# Altium project KC_BaseBoard4CompareTest_V0.2.PrjPcb
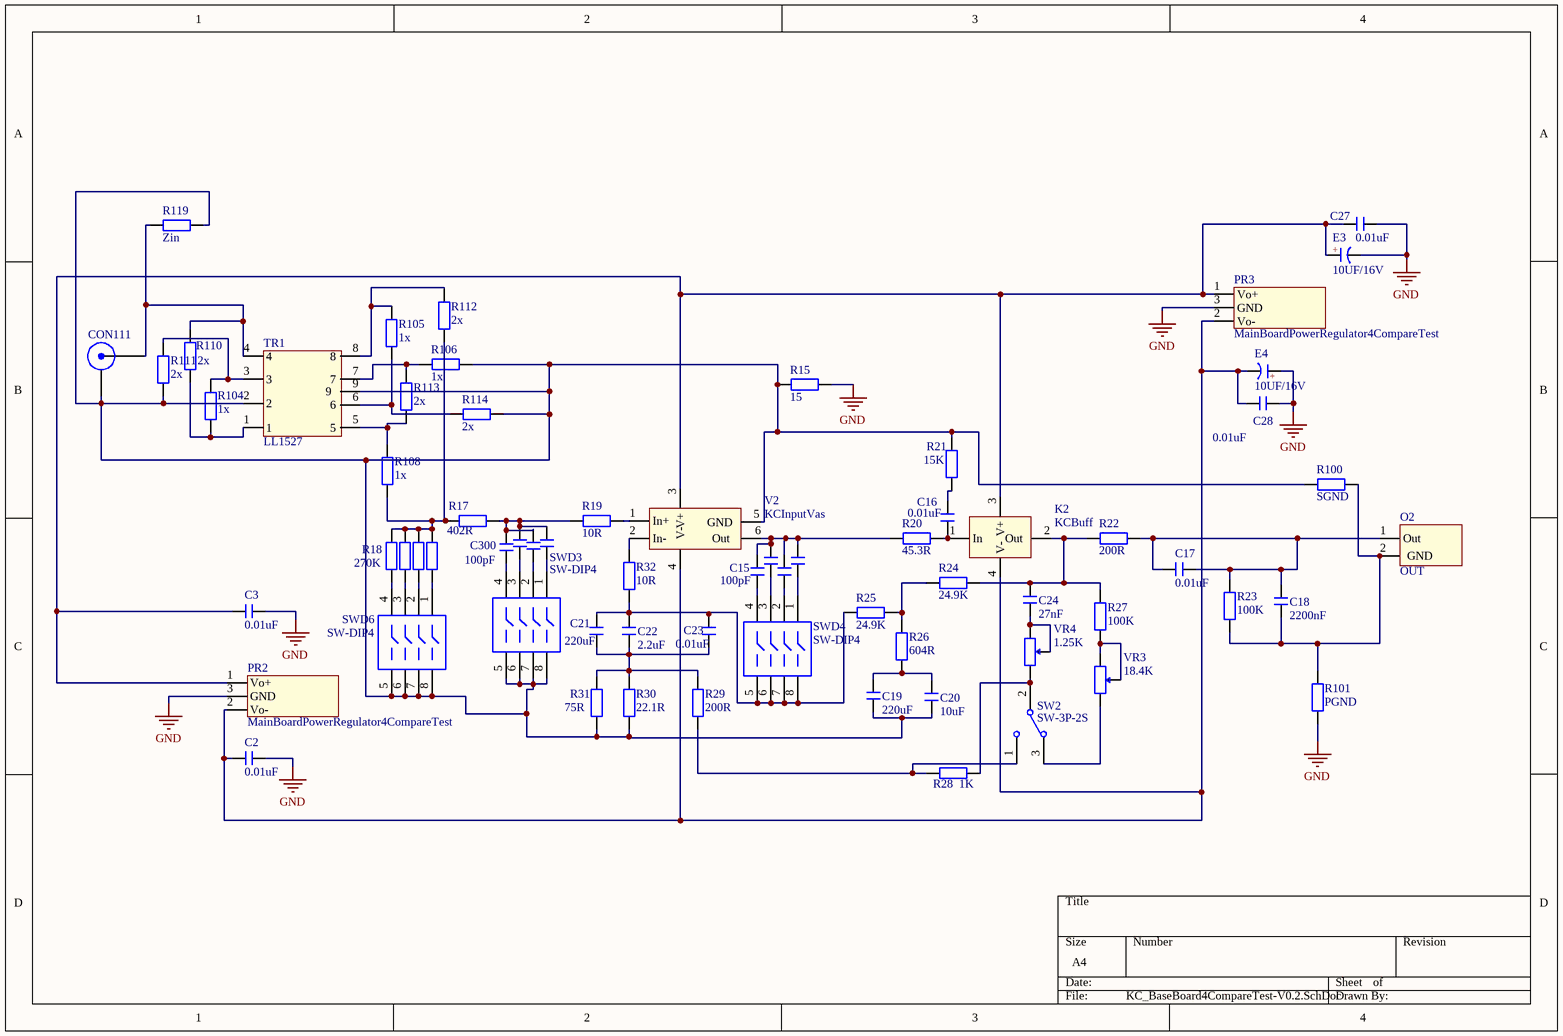
[diagram p0: KC_BaseBoard4CompareTest-V0.2.SchDoc]
1 sheet, 68 parts. Net scope: global (net labels, ports and power ports of the same name join across sheets).
Board file: KC_BaseBoard4CompareTest-V0.2.PcbDoc

## Sheet KC_BaseBoard4CompareTest-V0.2.SchDoc
size A4

### Parts
C2  0.01uF  [CBB 6.3*6.3*5]
C3  0.01uF  [CBB 6.3*6.3*5]
C15  100pF  [CBB 6.3*6.3*5]
C16  0.01uF  [CBB 6.3*6.3*5]
C17  0.01uF  [CBB 6.3*6.3*5]
C18  2200nF  [CBB 6.3*6.3*5]
C19  220uF  [CBB 6.3*6.3*5]
C20  10uF  [CBB 6.3*6.3*5]
C21  220uF  [CBB 6.3*6.3*5]
C22  2.2uF  [CBB 6.3*6.3*5]
C23  0.01uF  [CBB 6.3*6.3*5]
C24  27nF  [CBB 6.3*6.3*5]
C27  0.01uF  [CBB 6.3*6.3*5]
C28  0.01uF  [CBB 6.3*6.3*5]
C300  100pF  [CBB 6.3*6.3*5]
C301  100pF  [CBB 6.3*6.3*5]  (value not drawn)
C302  100pF  [CBB 6.3*6.3*5]  (value not drawn)
C303  20pF  [CBB 6.3*6.3*5]  (value not drawn)
C401  100pF  [CBB 6.3*6.3*5]  (value not drawn)
C402  100pF  [CBB 6.3*6.3*5]  (value not drawn)
C403  20pF  [CBB 6.3*6.3*5]  (value not drawn)
CON111  RCA  [SMB_V-RJ45]  (value not drawn)
E3  10UF/16V  [CAP 1.5*4*8]
E4  10UF/16V  [CAP 1.5*4*8]
K2  KCBuff  [KCBuff_M4]
O2  OUT  [Signal_Terminal]
PR2  MainBoardPowerRegulator4CompareTest  [KC_MBPowerReg4Compare-1.5mm]
PR3  MainBoardPowerRegulator4CompareTest  [KC_MBPowerReg4Compare-1.5mm]
R15  15  [RS 1/4W]
R17  402R  [RS 1/4W]
R18  270K  [RS 1/4W]
R19  10R  [RS 1/4W]
R20  45.3R  [RS 1/4W]
R21  15K  [RS 1/4W]
R22  200R  [RS 1/4W]
R23  100K  [RS 1/4W]
R24  24.9K  [RS 1/4W]
R25  24.9K  [RS 1/4W]
R26  604R  [RS 1/4W]
R27  100K  [RS 1/4W]
R28  1K  [RS 1/4W]
R29  200R  [RS 1/4W]
R30  22.1R  [RS 1/4W]
R31  75R  [RS 1/4W]
R32  10R  [RS 1/4W]
R100  SGND  [RS 1/4W]
R101  PGND  [RS 1/4W]
R104  1x  [RS 1/4W]
R105  1x  [RS 1/4W]
R106  1x  [RS 1/4W]
R108  1x  [RS 1/4W]
R110  2x  [RS 1/4W]
R111  2x  [RS 1/4W]
R112  2x  [RS 1/4W]
R113  2x  [RS 1/4W]
R114  2x  [RS 1/4W]
R119  Zin  [RS 1/4W]
R181  182K  [RS 1/4W]  (value not drawn)
R182  100K  [RS 1/4W]  (value not drawn)
R183  47K  [RS 1/4W]  (value not drawn)
SW2  SW-3P-2S  [SS-12D06]
SWD3  SW-DIP4  [DIP-8]
SWD4  SW-DIP4  [DIP-8]
SWD6  SW-DIP4  [DIP-8]
TR1  LL1527  [LL1527]
V2  KCInputVas  [KCIn_VAS_M4]
VR3  18.4K  [RS 1/2W-VR]
VR4  1.25K  [RS 1/2W-VR]

### Nets
GND: C2.2 C3.2 C27.2 C28.2 E3.2(K) E4.1(A) PR2.3(GND) PR3.3(GND) R15.2 R101.1
NetC2_1: C2.1 C28.1 E4.2(K) K2.4(V-) PR2.2(Vo-) PR3.2(Vo-) V2.4(V-)
NetC3_1: C3.1 C27.1 E3.1(A) K2.3(V+) PR2.1(Vo+) PR3.1(Vo+) V2.3(V+)
NetC15_1: C15.1 SWD4.4
NetC15_2: C15.2 C401.2 C402.2 C403.2 R20.1 V2.6(Out)
NetC16_1: C16.1 K2.1(In) R20.2
NetC16_2: C16.2 R21.1
NetC17_1: C17.1 C17.2 C18.1 O2.1(Out) R22.1 R23.1
NetC18_2: C18.2 O2.2(GND) R23.2 R100.2 R101.2
NetC19_1: C19.1 C20.1 R26.1
NetC19_2: C19.2 C20.2 CON111.2(Y) R15.1 R21.2 R30.1 R31.1 R100.1 R106.2 R111.1 R114.2 R119.2 SWD3.5 SWD3.6 SWD3.7 SWD3.8 SWD6.5 SWD6.6 SWD6.7 SWD6.8 TR1.2 TR1.9 V2.5(GND)
NetC21_1: C21.1 C22.1 C23.1 R25.1 R32.1 SWD4.5 SWD4.6 SWD4.7 SWD4.8
NetC21_2: C21.2 C22.2 C23.2 R29.2 R30.2 R31.2
NetC24_1: C24.1 K2.2(Out) R22.2 R24.2 R27.1
NetC24_2: C24.2 VR4.1 VR4.3
NetC300_1: C300.1 SWD3.4
NetC300_2: C300.2 C301.2 C302.2 C303.2 R17.2 R19.1
NetC301_1: C301.1 SWD3.3
NetC302_1: C302.1 SWD3.2
NetC303_1: C303.1 SWD3.1
NetC401_1: C401.1 SWD4.3
NetC402_1: C402.1 SWD4.2
NetC403_1: C403.1 SWD4.1
NetCON111_1: CON111.1(X) R110.2 R119.1 TR1.4
NetR17_1: R17.1 R18.2 R108.1 R112.1 R181.2 R182.2 R183.2
NetR18_1: R18.1 SWD6.4
NetR19_2: R19.2 V2.1(In+)
NetR24_1: R24.1 R25.2 R26.2
NetR27_2: R27.2 VR3.1 VR3.3
NetR28_1: R28.1 R29.1 SW2.1
NetR28_2: R28.2 SW2.2 VR4.2
NetR32_2: R32.2 V2.2(In-)
NetR104_1: R104.1 R110.1 TR1.1
NetR104_2: R104.2 R111.2 TR1.3
NetR105_1: R105.1 R114.1 TR1.6
NetR105_2: R105.2 R112.2 TR1.8
NetR106_1: R106.1 R113.2 TR1.7
NetR108_2: R108.2 R113.1 TR1.5
NetR181_1: R181.1 SWD6.3
NetR182_1: R182.1 SWD6.2
NetR183_1: R183.1 SWD6.1
NetSW2_3: SW2.3 VR3.2

### Notes on the sheet
- (in symbol C-CAP) +

### Library data of the parts
C2 C3 C15-C24 C27 C28 C300-C303 C401-C403 = C-CBB: CBB电容; 版权归属: 源创客; BOM名称: CBB电容; 学习资源: www.ooocke.com
CON111 = RCA: RCA Connector; Revision: 17-Jul-2002: Re-released for DXP Platform.; Publisher: Altium Limited
E3 E4 = C-CAP: 直插电解电容; 版权归属: 源创客; BOM名称: 直插电解电容; 学习资源: www.ooocke.com
K2 = KCBuff: King Cello Buffer Stage
O2 = Signal_Out: Signal Out
PR2 PR3 = MainBoardPowerRegulator4CompareTest: King Cello Compare Test Power
R15 R17-R32 R100 R101 R104-R106 R108 R110-R114 R119 R181-R183 = R-CRR: 直插色环电阻; BOM名称: 色环电阻; 版权归属: 源创客; 学习资源: www.ooocke.com
SW2 = SW-3P-2S: 3 Pin 2 Switch
SWD3 SWD4 SWD6 = SW-DIP4: DIP Switch; Published: 24-Mar-1999; LatestRevisionDate: 17-Jul-2002; LatestRevisionNote: Re-released for DXP Platform.; PackageReference: DIP-8; Publisher: Altium Limited
TR1 = LL1527: Lundahl LL1527
V2 = KCInputVas: King Cello Input Stage and VAS
VR3 VR4 = VR-W: 直插可调电阻-顶调